# Altium schematic sheet CAN_PHY.SchDoc: CAN PHY
size 431 x 279 mm; Author: Shivam Sharma; SheetNumber: 3; SheetTotal: 14; SheetRevision: 1.0
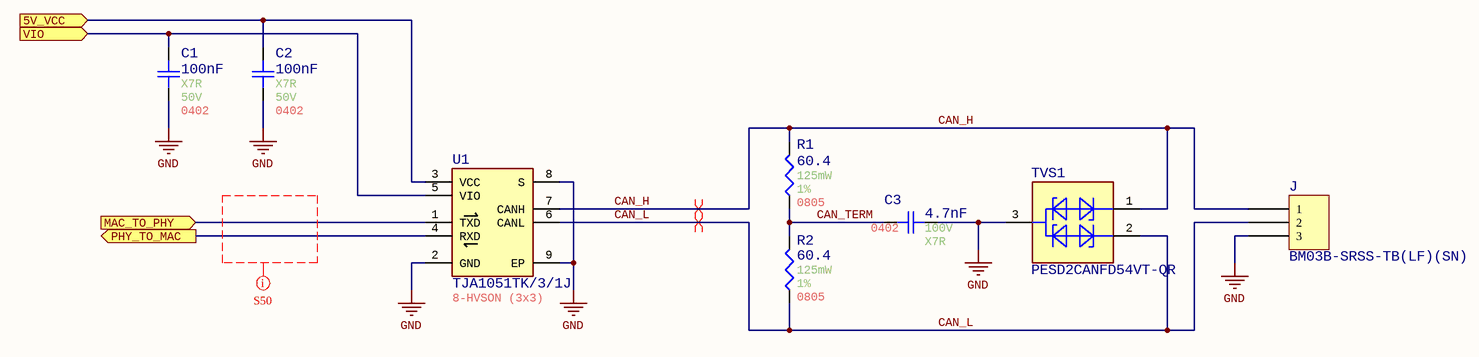
[diagram p0: CAN_PHY.SchDoc]

## Parts
C1  value 100nF  Temperature Coefficient: X7R  Voltage Rating: 50V  Case/Package: 0402  [Generic 0402 capacitor]  (hidden comment: GRT155R71H104KE01D)
C2  value 100nF  Temperature Coefficient: X7R  Voltage Rating: 50V  Case/Package: 0402  [Generic 0402 capacitor]  (hidden comment: GRT155R71H104KE01D)
C3  value 4.7nF  Temperature Coefficient: X7R  Voltage Rating: 100V  Case/Package: 0402  [Generic 0402 capacitor]  (hidden comment: GCM155R72A472KA37D)
J  BM03B-SRSS-TB(LF)(SN)  [JST BM03B-SRSS-TB]
R1  value 60.4  Power: 125mW  Tolerance: 1%  Case/Package: 0805  [0805 Resistor]  (hidden comment: TFA0805R60R4F-T5)
R2  value 60.4  Power: 125mW  Tolerance: 1%  Case/Package: 0805  [0805 Resistor]  (hidden comment: TFA0805R60R4F-T5)
TVS1  PESD2CANFD54VT-QR  [PESD2CANFD54VT-QR]
U1  TJA1051TK/3/1J  Case/Package: 8-HVSON (3x3)  [TJA1044xxK]

## Ports
5V_VCC (in), MAC_TO_PHY (in), PHY_TO_MAC (out), VIO (in)

## Nets
GND: C1.2 C2.2 C3.1 J.3 TVS1.3(CC) U1.2(GND) U1.8(S) U1.9(EP)
5V_VCC: C2.1 U1.3(VCC) ; port 5V_VCC
CAN_H: J.1 R1.2 TVS1.1(K1) U1.7(CANH)
CAN_L: J.2 R2.1 TVS1.2(K2) U1.6(CANL)
CAN_TERM: C3.2 R1.1 R2.2
MAC_TO_PHY: U1.1(TXD) ; port MAC_TO_PHY
PHY_TO_MAC: U1.4(RXD) ; port PHY_TO_MAC
VIO: C1.1 U1.5(VIO) ; port VIO

## Layout directives
differential pair; differential pair class CAN: CAN_H, CAN_L
net class S50: (no net found under the mark)

## Notes on the sheet
- Title:
- Author:
- Approved:
- Size:
- Date:
- Git Hash:
- Sch Revision:
- B
- Prj:
- Sheet Revision:
- Variant:
- Edited:
- CONFIDENTIAL
- File:

## Library data of the parts
C1 C2 = CMP-001-00084-12: Ceramic Capacitor, Multilayer, Ceramic, 50V, 10% +Tol, 10% -Tol, X7R, 15% TC, 0.1uF, Surface Mount, 0402; AECQ: Yes; RoHS Compliant: Yes; Package Shape: Rectangular; Max Operating Temperature: 125°C; Terminal Finish: Nickel; Multilayer: Yes; Dielectric Material: Ceramic; Mounting Technology: Surface Mount; Termination: Wraparound; Reach SVHC Compliant: Yes; Min Operating Temperature: -55°C; Tolerance: 10%; Packaging: Tape and Reel; Pins: 2; Capacitor Type: Ceramic
C3 = CMP-001-00110-2: Ceramic Capacitor, Multilayer, Ceramic, 100V, 10% +Tol, 10% -Tol, X7R, 15% TC, 0.0047uF, Surface Mount, 0402; AECQ: Yes; Min Operating Temperature: -55°C; Mounting Technology: SMD; Tolerance: 10%; Max Operating Temperature: 125°C; RoHS Compliant: Yes; Pins: 2; Capacitor Type: Ceramic
J = BM03B-SRSS-TB(LF)(SN): CONN HEADER SMD 3POS 1MM; Manufacturer: JST Sales America Inc.; Current Rating (Amps): 0.7A; Material Flammability Rating: UL94 V-0; Number of Positions: 3; Number of Positions Loaded: All; Pitch - Mating: 0.039" (1.00mm); Shrouding: Shrouded - 4 Wall; Style: Board to Cable/Wire; Voltage Rating: 50V; Part Number: BM03B-SRSS-TB(LF)(SN); ComponentLink1Description: Datasheet; ComponentLink1URL: http://www.jst-mfg.com/product/pdf/eng/eSR.pdf; ComponentLink2Description: DigiKey Link; ComponentLink2URL: http://digikey.com/product-detail/en/jst-sales-america-inc/BM03B-SRSS-TB-LF-SN/455-1789-1-ND/926860; Connector Type: Header; Contact Finish - Mating: Tin; Contact Finish - Post: Tin; Contact Material: Copper Alloy; Contact Shape: Square; Contact Type: Male Pin; Fastening Type: Push-Pull; Features: Solder Retention; Insulation Color: Natural; Insulation Height: 0.167" (4.25mm); Insulation Material: Polyamide (PA), Nylon; LastUpdated: 1/12/2020 10:12:14 PM; Lifecycle Status: Active; Minimum Order: 1; Mounting Type: Surface Mount; Number of Rows: 1; Operating Temperature: -25°C ~ 85°C; Packaging: TapeAndReel; PartId: 14; Part Status: Active; Price: 0.24; Series: SR; Supplier 1: DigiKey; Supplier Part Number 1: 455-1789-1-ND; Termination: Solder
R1 R2 = CMP-009-00189-2: Res 60.4 Ohm 1% 1/8W 0805; AECQ: Yes; Manufacturer Part Number: TFA0805R60R4F-T5; Mounting Technology: SMD; Pins: 2
TVS1 = CMP-004-00032-1: ESD protection for in-vehicle networks; AECQ: Yes; Pins: 3; Case/Package: TO-236AB
U1 = CMP-031-00007-4: Interface Circuit, PDSO8; AECQ: Yes; Max Operating Temperature: 150°C; Pins: 8; Min Operating Temperature: -40°C; MPN: TJA1051TK/3/1J